# Altium schematic sheet 6) Nand Flash,NOR Flash.SchDoc
size 420 x 297 mm
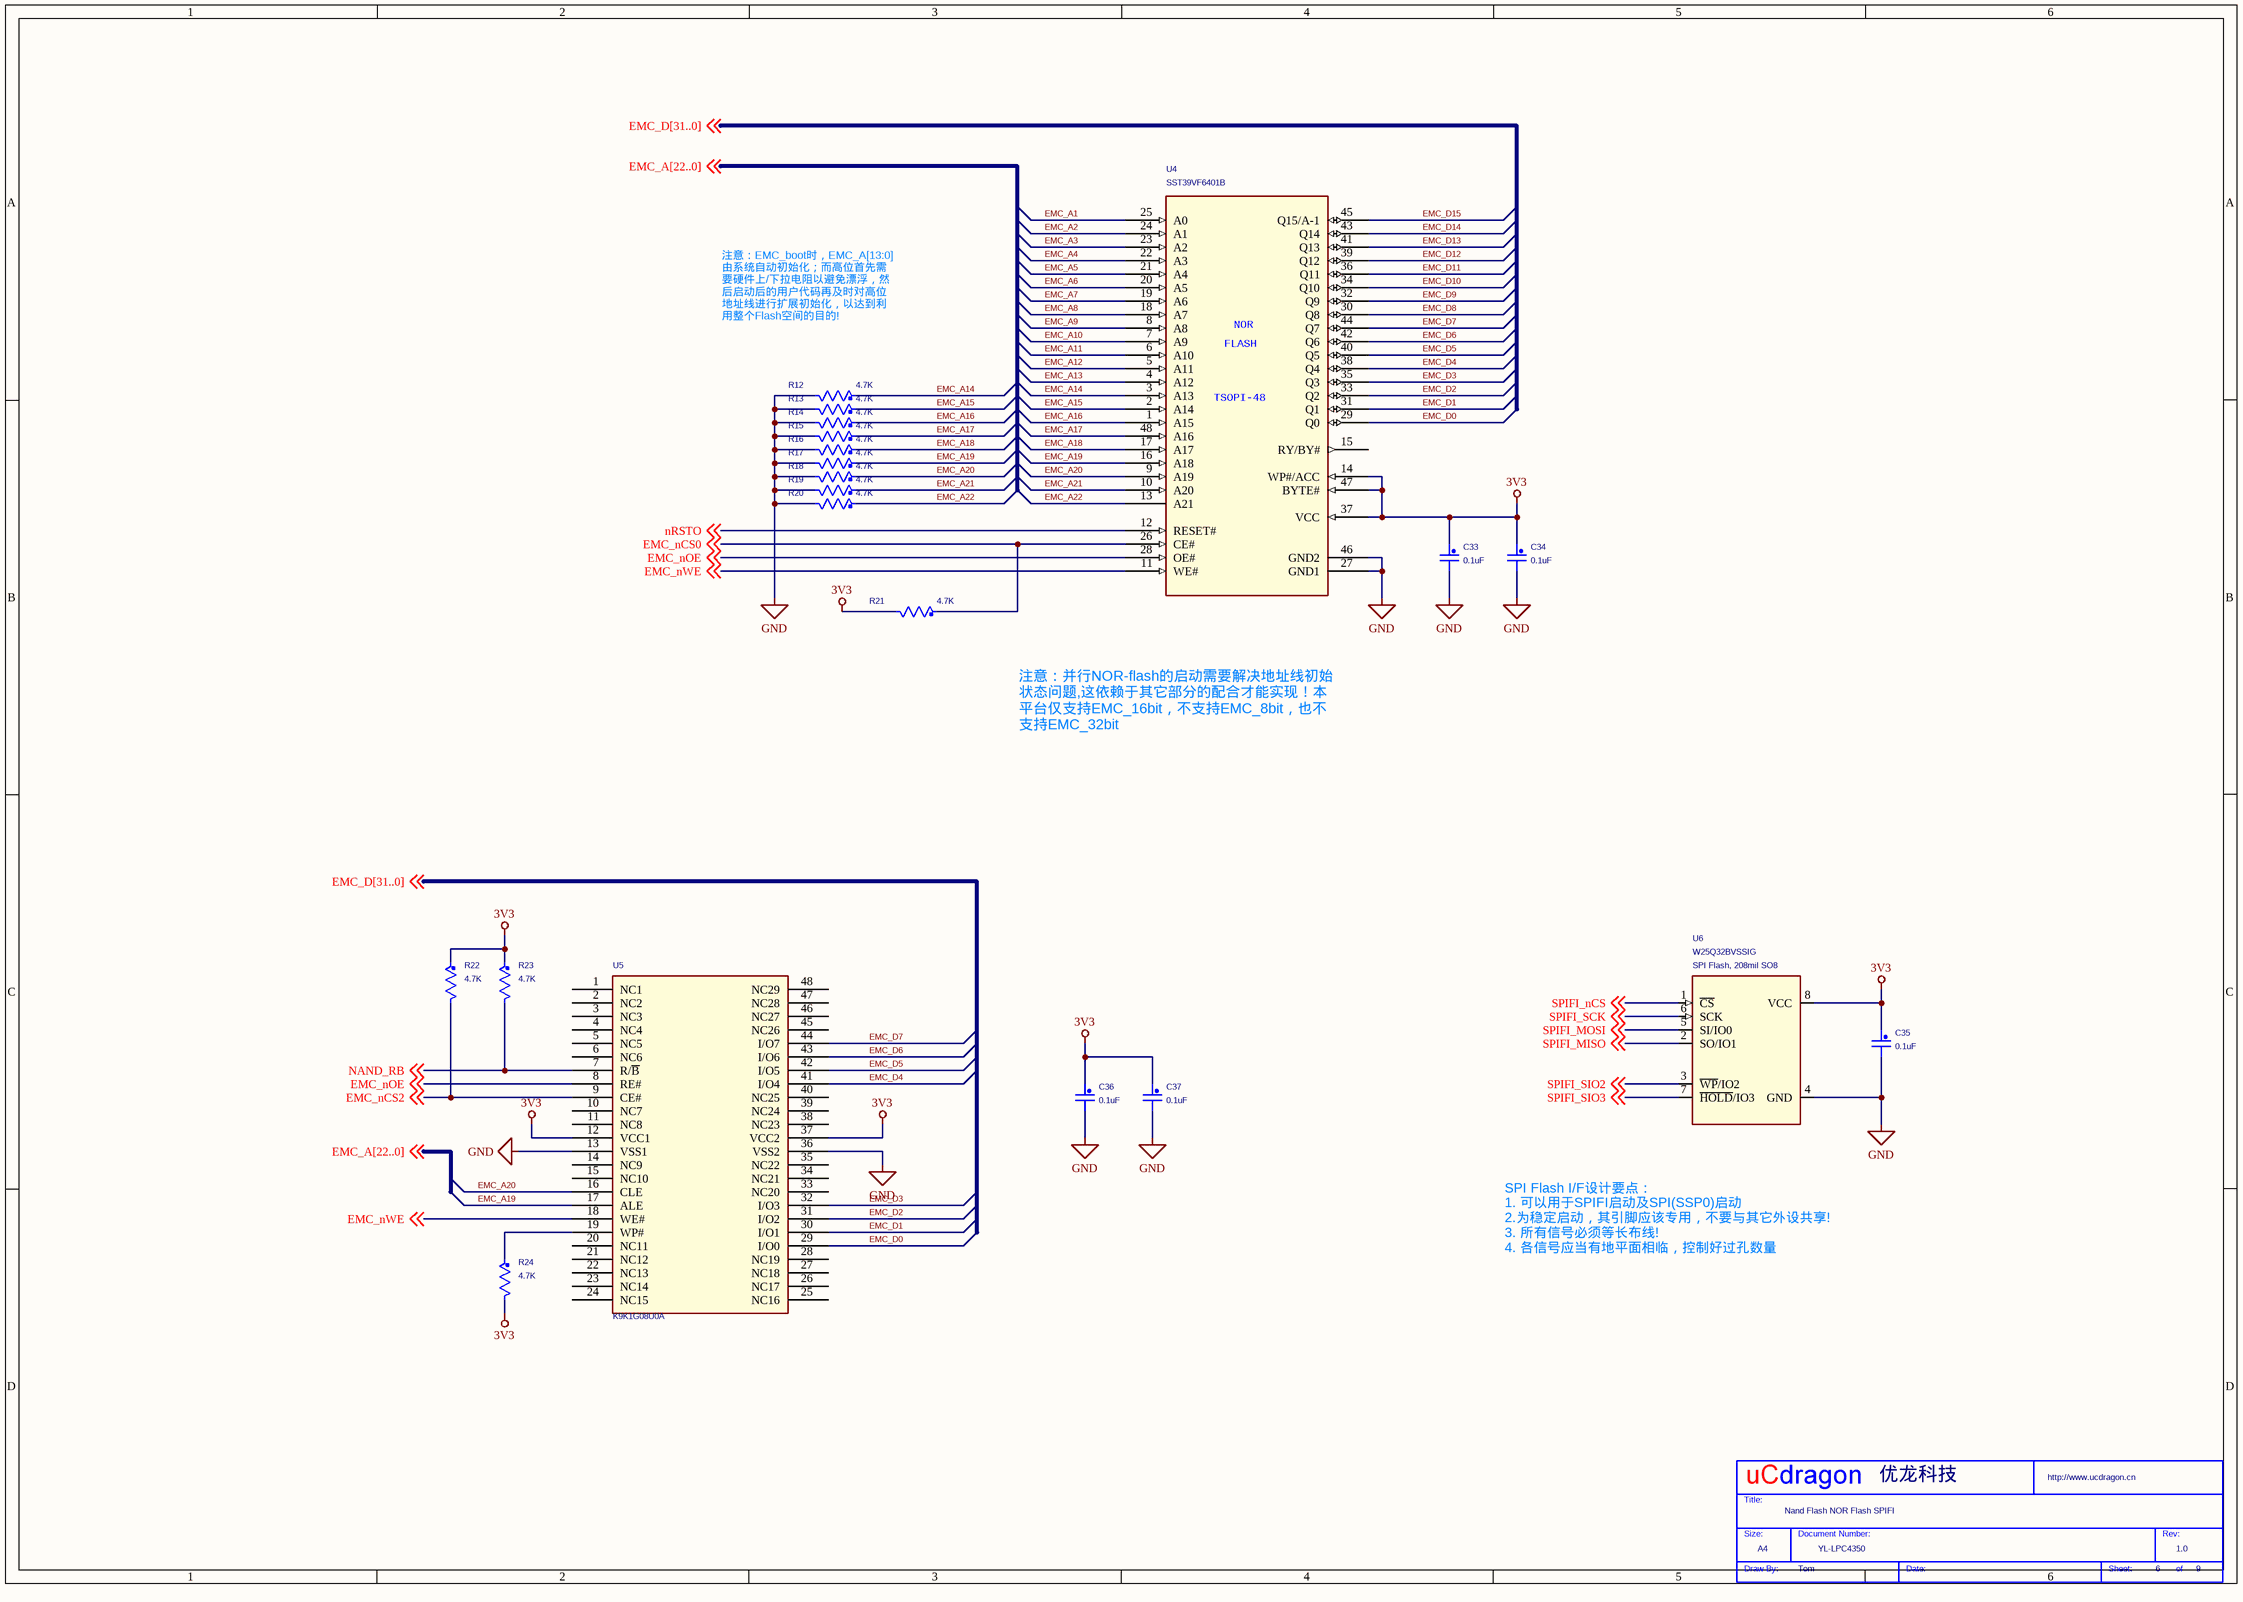
[diagram p0: 6) Nand Flash,NOR Flash.SchDoc]

## Parts
*  Company: 优龙科技  Drawing: Tom  Doc: YL-LPC4350  RevCode: 1.0  Title: Nand Flash NOR Flash SPIFI  Page Size: A4  Page Number: 6  Page Count: 9  (hidden comment: My Title 0)  (graphical)
C33  0.1uF  [CAP0805]
C34  0.1uF  [CAP0805]
C35  0.1uF  [CAP0805]
C36  0.1uF  [CAP0805]
C37  0.1uF  [CAP0805]
R12  4.7K  [R0603]
R13  4.7K  [R0603]
R14  4.7K  [R0603]
R15  4.7K  [R0603]
R16  4.7K  [R0603]
R17  4.7K  [R0603]
R18  4.7K  [R0603]
R19  4.7K  [R0603]
R20  4.7K  [R0603]
R21  4.7K  [R0603]
R22  4.7K  [R0603]
R23  4.7K  [R0603]
R24  4.7K  [R0603]
U4  SST39VF6401B  [TSOPI-48]
U5  K9K1G08U0A  [TSOP1]
U6  W25Q32BVSSIG  Note: SPI Flash, 208mil SO8  [W25Q32_SO8_208MIL]

## Nets
3V3: C33.1 C34.1 C35.1 C36.1 C37.1 R21.2 R22.1 R23.1 R24.2 U4.14(WP#/ACC) U4.37(VCC) U4.47(BYTE#) U5.12(VCC1) U5.37(VCC2) U6.8(VCC)
GND: C33.2 C34.2 C35.2 C36.2 C37.2 R12.2 R13.2 R14.2 R15.2 R16.2 R17.2 R18.2 R19.2 R20.2 U4.27(GND1) U4.46(GND2) U5.13(VSS1) U5.36(VSS2) U6.4(GND)
EMC_A1: U4.25(A0)
EMC_A2: U4.24(A1)
EMC_A3: U4.23(A2)
EMC_A4: U4.22(A3)
EMC_A5: U4.21(A4)
EMC_A6: U4.20(A5)
EMC_A7: U4.19(A6)
EMC_A8: U4.18(A7)
EMC_A9: U4.8(A8)
EMC_A10: U4.7(A9)
EMC_A11: U4.6(A10)
EMC_A12: U4.5(A11)
EMC_A13: U4.4(A12)
EMC_A14: R12.1 U4.3(A13)
EMC_A15: R13.1 U4.2(A14)
EMC_A16: R14.1 U4.1(A15)
EMC_A17: R15.1 U4.48(A16)
EMC_A18: R16.1 U4.17(A17)
EMC_A19: R17.1 U4.16(A18) U5.17(ALE)
EMC_A20: R18.1 U4.9(A19) U5.16(CLE)
EMC_A21: R19.1 U4.10(A20)
EMC_A22: R20.1 U4.13(A21)
EMC_D0: U4.29(Q0) U5.29(I/O0)
EMC_D1: U4.31(Q1) U5.30(I/O1)
EMC_D2: U4.33(Q2) U5.31(I/O2)
EMC_D3: U4.35(Q3) U5.32(I/O3)
EMC_D4: U4.38(Q4) U5.41(I/O4)
EMC_D5: U4.40(Q5) U5.42(I/O5)
EMC_D6: U4.42(Q6) U5.43(I/O6)
EMC_D7: U4.44(Q7) U5.44(I/O7)
EMC_D8: U4.30(Q8)
EMC_D9: U4.32(Q9)
EMC_D10: U4.34(Q10)
EMC_D11: U4.36(Q11)
EMC_D12: U4.39(Q12)
EMC_D13: U4.41(Q13)
EMC_D14: U4.43(Q14)
EMC_D15: U4.45(Q15/A-1)
EMC_nCS0: R21.1 U4.26(CE#) ; off-sheet EMC_nCS0
EMC_nCS2: R22.2 U5.9(CE#) ; off-sheet EMC_nCS2
EMC_nOE: U4.28(OE#) U5.8(RE#) ; off-sheet EMC_nOE
EMC_nWE: U4.11(WE#) U5.18(WE#) ; off-sheet EMC_nWE
NAND_RB: R23.2 U5.7(R/~{B}) ; off-sheet NAND_RB
nRSTO: U4.12(RESET#) ; off-sheet nRSTO
SPIFI_MISO: U6.2(SO/IO1) ; off-sheet SPIFI_MISO
SPIFI_MOSI: U6.5(SI/IO0) ; off-sheet SPIFI_MOSI
SPIFI_nCS: U6.1(~{CS}) ; off-sheet SPIFI_nCS
SPIFI_SCK: U6.6(SCK) ; off-sheet SPIFI_SCK
SPIFI_SIO2: U6.3(~{WP}/IO2) ; off-sheet SPIFI_SIO2
SPIFI_SIO3: U6.7(~{HOLD}/IO3) ; off-sheet SPIFI_SIO3
NetR24_1: R24.1 U5.19(WP#)

Not connected (* = marked no-connect by the designer): U4 15(RY/BY#); U5 1(NC1) 2(NC2) 3(NC3) 4(NC4) 5(NC5) 6(NC6) 10(NC7) 11(NC8) 14(NC9) 15(NC10) 20(NC11) 21(NC12) 22(NC13) 23(NC14) 24(NC15) 25(NC16) 26(NC17) 27(NC18) 28(NC19) 33(NC20) 34(NC21) 35(NC22) 38(NC23) 39(NC24) 40(NC25) 45(NC26) 46(NC27) 47(NC28) 48(NC29)

## Notes on the sheet
- 注意：EMC_boot时，EMC_A[13:0]
  由系统自动初始化；而高位首先需
  要硬件上/下拉电阻以避免漂浮，然
  后启动后的用户代码再及时对高位
  地址线进行扩展初始化，以达到利
  用整个Flash空间的目的!
- 注意：并行NOR-flash的启动需要解决地址线初始
  状态问题,这依赖于其它部分的配合才能实现！本
  平台仅支持EMC_16bit，不支持EMC_8bit，也不
  支持EMC_32bit
- SPI Flash I/F设计要点：
  1. 可以用于SPIFI启动及SPI(SSP0)启动
  2.为稳定启动，其引脚应该专用，不要与其它外设共享!
  3. 所有信号必须等长布线!
  4. 各信号应当有地平面相临，控制好过孔数量
- (in symbol MX29LV640EBTI-70G) NOR; FLASH; TSOPI-48
- (in symbol My Title 0) Title:; Size:; Document Number:; Rev:; Draw By:; Date:; Sheet:; of

## Library data of the parts
C33-C37 = C_Generic: Toler.: 10%; P/N #1: C0603C104K4RAC; Voltage: 16V; Mfg #1: KEMET; Dielectric: X7R
R12-R24 = R_Generic_Dup1: Mfg #1: KOA SPEER; P/N #1: RK73H1JT1002F; Watts: 0.1W; Toler.: 1%; P/N #3: CR10-103J-T; Mfg #3: AVX
U4 = MX29LV640EBTI-70G
U6 = SPI FLASH 4IO WSO8
* = My Title 0: WebSite: http://www.ucdragon.cn; Page Create Date: May 29, 2006